# Altium schematic sheet Main_Board_Schematic.SchDoc
size A4; SheetNumber: 1; SheetTotal: 1
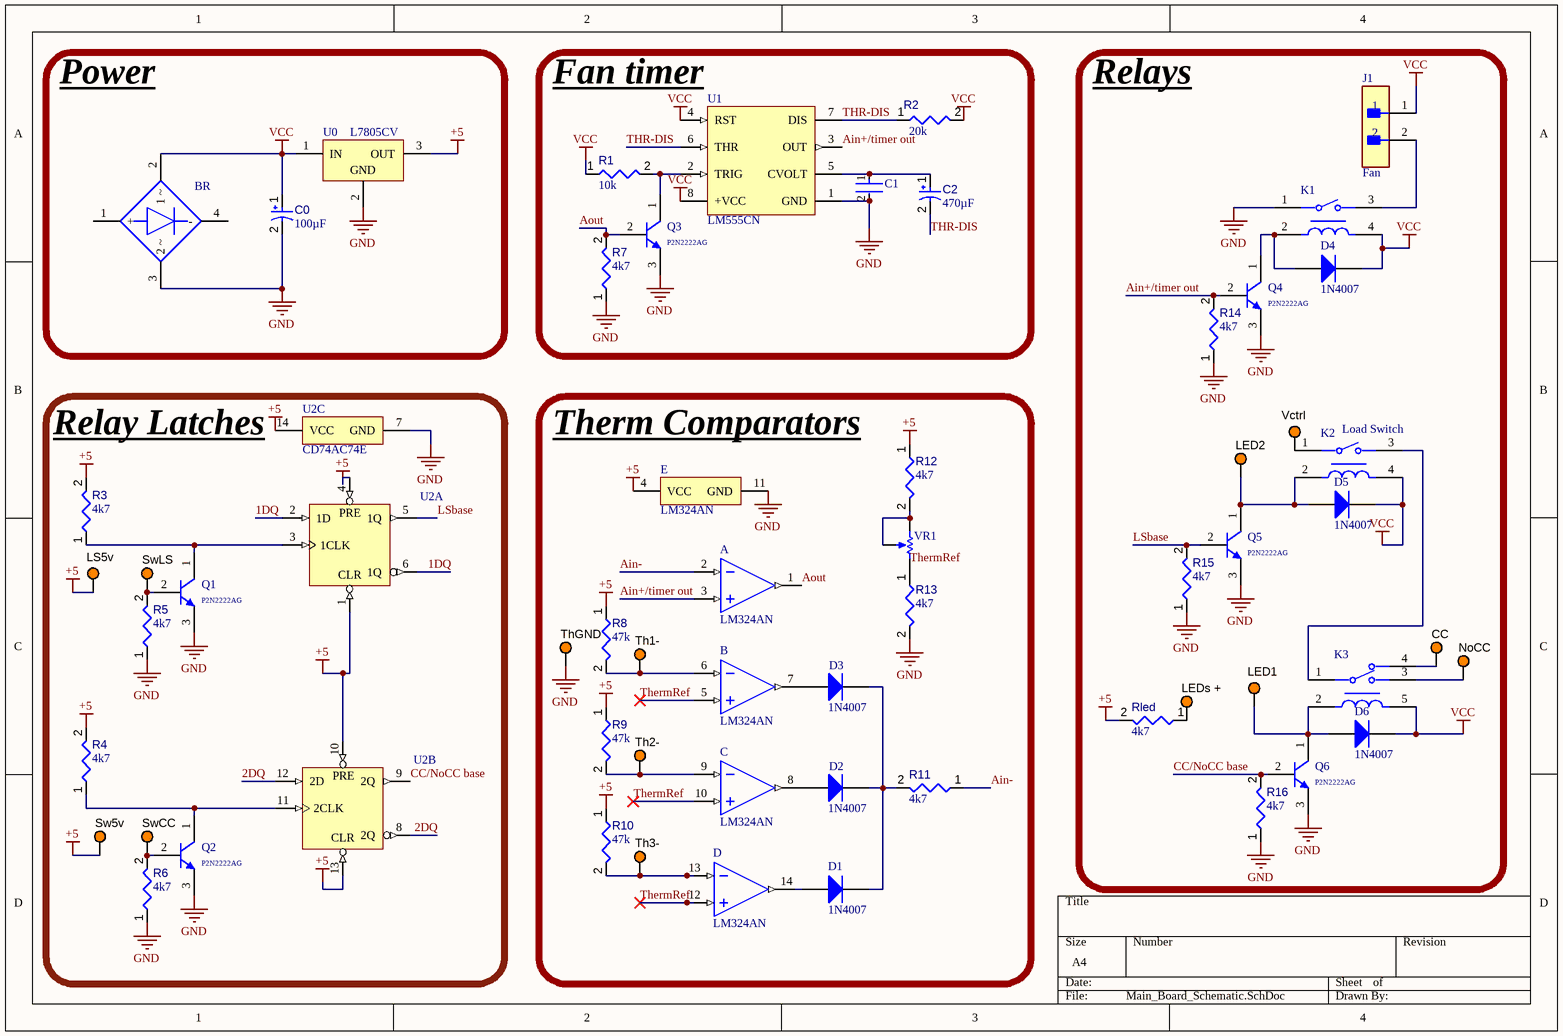
[diagram p0: Main_Board_Schematic.SchDoc]

## Parts
(Parts that share a designator on the sheet are numbered #1, #2 ... from top to bottom, then left to right.)
?#1  LM324AN  [TI-N0014A]  (part E of 5)
?#2  LM324AN  [TI-N0014A]  (part A of 5)
?#3  LM324AN  [TI-N0014A]  (part B of 5)
?#4  LM324AN  [TI-N0014A]  (part C of 5)
?#5  LM324AN  [TI-N0014A]  (part D of 5)
BR  GBU8D  [FP-127EL-MFG]  (value not drawn)
C0  value 100µF  [CAPPR55-250-1120X630X1220]  (hidden comment: ECA-2AM220)
C1  RCER71H103K0K1H03B  [FP-RCE0K1-MFG]  (value not drawn)
C2  value 470µF  [CAPPR65-350-1150X800X1250]  (hidden comment: ECA1HM101)
CC  5003  [KSTN-5003]  (value not drawn)
D1  1N4007  [FAIR-DO-41-2]
D2  1N4007  [FAIR-DO-41-2]
D3  1N4007  [FAIR-DO-41-2]
D4  1N4007  [FAIR-DO-41-2]
D5  1N4007  [FAIR-DO-41-2]
D6  1N4007  [FAIR-DO-41-2]
J1  Fan  [FP-B2B-XH-A_LF_SN-MFG]
K1  LKQ1AF-5V-TV-5  [FP-LKQ1AF-5V-TV-5-MFG]  (value not drawn)
K2  Load Switch  [FP-LKQ1AF-5V-TV-5-MFG]
K3  G5LE-14-36 DC12  [FP-G5LE-14-36_DC12-MFG]  (value not drawn)
LED1  5003  [KSTN-5003]  (value not drawn)
LED2  5003  [KSTN-5003]  (value not drawn)
LEDs_+  5003  [KSTN-5003]  (value not drawn)
LS5v  5003  [KSTN-5003]  (value not drawn)
NoCC  5003  [KSTN-5003]  (value not drawn)
Q1  P2N2222AG  [ONSC-TO-92-3-29-11]
Q2  P2N2222AG  [ONSC-TO-92-3-29-11]
Q3  P2N2222AG  [ONSC-TO-92-3-29-11]
Q4  P2N2222AG  [ONSC-TO-92-3-29-11]
Q5  P2N2222AG  [ONSC-TO-92-3-29-11]
Q6  P2N2222AG  [ONSC-TO-92-3-29-11]
R1  value 10k  [RESA60-630X240]  (hidden comment: MFR-25FBF52-1K)
R2  value 20k  [RESA60-630X240]  (hidden comment: MFR-25FBF52-1K)
R3  value 4k7  [RESA60-630X240]  (hidden comment: MFR-25FBF52-100R)
R4  value 4k7  [RESA60-630X240]  (hidden comment: MFR-25FBF52-100R)
R5  value 4k7  [RESA60-630X240]  (hidden comment: MFR-25FBF52-100R)
R6  value 4k7  [RESA60-630X240]  (hidden comment: MFR-25FBF52-100R)
R7  value 4k7  [RESA60-630X240]  (hidden comment: MFR-25FBF52-100R)
R8  value 47k  [RESA60-630X240]  (hidden comment: MFR-25FBF52-100R)
R9  value 47k  [RESA60-630X240]  (hidden comment: MFR-25FBF52-100R)
R10  value 47k  [RESA60-630X240]  (hidden comment: MFR-25FBF52-100R)
R11  value 4k7  [RESA60-630X240]  (hidden comment: MFR-25FBF52-100R)
R12  value 4k7  [RESA60-630X240]  (hidden comment: MFR-25FBF52-100R)
R13  value 4k7  [RESA60-630X240]  (hidden comment: MFR-25FBF52-100R)
R14  value 4k7  [RESA60-630X240]  (hidden comment: MFR-25FBF52-100R)
R15  value 4k7  [RESA60-630X240]  (hidden comment: MFR-25FBF52-100R)
R16  value 4k7  [RESA60-630X240]  (hidden comment: MFR-25FBF52-100R)
Rled  value 4k7  [RESA60-630X240]  (hidden comment: MFR-25FBF52-100R)
Sw5v  5003  [KSTN-5003]  (value not drawn)
SwCC  5003  [KSTN-5003]  (value not drawn)
SwLS  5003  [KSTN-5003]  (value not drawn)
Th1-  5003  [KSTN-5003]  (value not drawn)
Th2-  5003  [KSTN-5003]  (value not drawn)
Th3-  5003  [KSTN-5003]  (value not drawn)
ThGND  5003  [KSTN-5003]  (value not drawn)
U0  L7805CV  [TO220]
U1  LM555CN  [N08E]
U2  CD74AC74E  [N0014A]  (value not drawn)  (parts A,B,C of 3)
Vctrl  5003  [KSTN-5003]  (value not drawn)
VR1  3362P-1-104LF  [BOUR-3362P]  (value not drawn)

## Blocks framed on the sheet
Power: BR C0 U0
Fan timer: C1 C2 Q3 R1 R2 R7 U1
Relays: CC D4-D6 J1 K1-K3 LED1 LED2 LEDs_+ NoCC Q4-Q6 R14-R16 Rled Vctrl
Relay Latches: LS5v Q1 Q2 R3-R6 Sw5v SwCC SwLS U2
Therm Comparators: ?#1-?#5 D1-D3 R8-R13 Th1- Th2- Th3- ThGND VR1

## Nets
+5: ?#1.4(VCC) LS5v.1 R3.2 R4.2 R8.1 R9.1 R10.1 R12.1 Rled.2 Sw5v.1 U0.3(OUT) U2.1(1~{CLR}) U2.4(1~{PRE}) U2.10(2~{PRE}) U2.13(2~{CLR}) U2.14(VCC)
GND: ?#1.11(GND) BR.3(2_~) C0.2 C1.2 K1.1 Q1.3(E) Q2.3(E) Q3.3(E) Q4.3(E) Q5.3(E) Q6.3(E) R5.1 R6.1 R7.1 R13.2 R14.1 R15.1 R16.1 ThGND.1 U0.2(GND) U1.1(GND) U2.7(GND)
VCC: BR.2(1_~) C0.1 D4.1(K) D5.1(K) D6.1(K) J1.1 K1.4 K2.4 K3.5 R1.1 R2.2 U0.1(IN) U1.4(RST) U1.8(+VCC)
1DQ: U2.2(1D) U2.6(1Q)
2DQ: U2.8(2Q) U2.12(2D)
Ain+/timer out: ?#2.3(1IN+) Q4.2(B) R14.2 U1.3(OUT)
Ain-: ?#2.2(1IN-) R11.1
Aout: ?#2.1(1OUT) Q3.2(B) R7.2
CC/NoCC base: Q6.2(B) R16.2 U2.9(2Q)
LSbase: Q5.2(B) R15.2 U2.5(1Q)
ThermRef: ?#3.5(2IN+) ?#4.10(3IN+) ?#5.12(4IN+)
THR-DIS: C2.2 R2.1 U1.6(THR) U1.7(DIS)
Net?#3_6: ?#3.6(2IN-) R8.2 Th1-.1
Net?#3_7: ?#3.7(2OUT) D3.2(A)
Net?#4_8: ?#4.8(3OUT) D2.2(A)
Net?#4_9: ?#4.9(3IN-) R9.2 Th2-.1
Net?#5_13: ?#5.13(4IN-) R10.2 Th3-.1
Net?#5_14: ?#5.14(4OUT) D1.2(A)
NetC1_1: C1.1 C2.1 U1.5(CVOLT)
NetCC_1: CC.1 K3.4
NetD1_1: D1.1(K) D2.1(K) D3.1(K) R11.2
NetD4_2: D4.2(A) K1.2 Q4.1(C)
NetD5_2: D5.2(A) K2.2 LED2.1 Q5.1(C)
NetD6_2: D6.2(A) K3.2 LED1.1 Q6.1(C)
NetJ1_2: J1.2 K1.3
NetK2_1: K2.1 Vctrl.1
NetK2_3: K2.3 K3.1
NetK3_3: K3.3 NoCC.1
NetLEDs_+_1: LEDs_+.1 Rled.1
NetQ1_1: Q1.1(C) R3.1 U2.3(1CLK)
NetQ1_2: Q1.2(B) R5.2 SwLS.1
NetQ2_1: Q2.1(C) R4.1 U2.11(2CLK)
NetQ2_2: Q2.2(B) R6.2 SwCC.1
NetQ3_1: Q3.1(C) R1.2 U1.2(TRIG)
NetR12_2: R12.2 VR1.1(CCW) VR1.2(S)
NetR13_1: R13.1 VR1.3(CW)

Not connected (* = marked no-connect by the designer): BR 1(+) 4(-)

## Notes on the sheet
- Labels drawn without touching a wire or pin: ThermRef
- (in symbol CMP-1619-00741-2, part A) PRE; CLR
- (in symbol CMP-1619-00741-2, part B) PRE; CLR

## Library data of the parts
?#1-?#5 = CMP-014-00016-2: Quadruple Operational Amplifier, 1.2 MHz, 0 to 70 degC, 14-Pin PDIP (N), Pb-Free (RoHS), Tube; Manufacturer: Texas Instruments (TI); Max Dual Supply Voltage: 16V; Nominal Dual Supply Voltage: 12V; Nominal Voltage Gain: 100dB; Min Supply Voltage: 1.5V; Unity Gain Bandwidth Product: 1.2MHz; Output Current: 30mA; Nominal Supply Current: 3mA; RoHS Compliant: True; Package Reference: N-14; Min Operating Temperature: 0°C; Case/Package: DIP; Mounting Technology: TH; Package Description: 14-Pin Double In-line Package, Body 19.305 x 6.35 mm, Pitch 2.54 mm; Nominal Supply Voltage: 12V; Package URL: http://www.ti.com/lit/ml/mpdi002c/mpdi002c.pdf; Package Quantity: 25; Datasheet Version: SLOS066W, 03/2015; Manufacturer URL: http://www.ti.com/; Datasheet URL: http://www.ti.com/lit/ds/symlink/lm324a.pdf; Min Dual Supply Voltage: 1.5V; Max Supply Voltage: 16V; Pins: 14; Max Operating Temperature: 70°C
BR = CMP-00278-84328822-1: GBU8D Diode Rectifier Bridge Single 200V 8A 4-Pin Case GBU Rail; Manufacturer Lifecycle Status: ACTIVE; Peak Reverse Current: 5µA; Max Forward Surge Current (Ifsm): 200A; Max Reverse Leakage Current: 50µA; Forward Voltage: 1V; Max Junction Temperature (Tj): 150°C; Number of Elements: 1; Power Dissipation: 16W; Element Configuration: Single; Radiation Hardening: No; Lifecycle Status: Production; Min Operating Temperature: -55°C; Height: 18.8mm; NexarPartId: 84328822; Mount: Through Hole; Width: 3.56mm; RoHS: Compliant; Average Rectified Current: 8A; Length: 22.3mm; Lead Free: Lead Free; Forward Current: 8A; Output Current: 8A; Max Operating Temperature: 150°C; Number of Pins: 4; Max Repetitive Reverse Voltage (Vrrm): 200V; Voltage Rating (DC): 200V; Weight: 5.4g; Contact Plating: Tin; Max Surge Current: 200A; Schedule B: 8541100080; Current Rating: 8A; REACH SVHC: No SVHC; Case/Package: SIP; Peak Non-Repetitive Surge Current: 200A; Reverse Voltage: 200V
C0 = CMP-001-00035-7: Aluminum Electrolytic Capacitor, 22 uF, +/- 20%, 100 V, -40 to 85 degC, 2-Pin THD, RoHS, Bulk; Manufacturer: Panasonic; Voltage Rating: 100V; Ripple Current: 115mA; Manufacturer URL: http://www.panasonic.com/; Packaging: Bulk; Package Description: 2-Pin Radial Lead, Dia 6.3 mm, Height 12.2 mm; Datasheet URL: https://industrial.panasonic.com/cdbs/www-data/pdf/RDF0000/ABA0000C1047.pdf; RoHS Compliant: True; Package Quantity: 200; Case/Package: Radial; Package Reference: CAPPR55-250-1120X630X1220; Datasheet Version: Mar-16; Pins: 2; Tolerance: 20%; Diameter: 6.3mm; Max Operating Temperature: 85°C; Ripple Current (AC): 115mA; Capacitor Type: Electrolytic; Mounting Technology: TH; Min Operating Temperature: -40°C; Lead Pitch: 2.5mm
C1 = CMP-06035-044411-1: Cap Ceramic 10nF 50V X7R ±10% Radial 5mm +125°C Automotive Bulk; Lead/Base Style: Formed Leads; Lead Diameter: 0.5mm; Resistor Type: Ceramic; Mount: Through Hole; Capacitance: 10nF; Lead Pitch: 0.197inch; Package Quantity: 500; Dielectric: X7R; Lead Free: Lead Free; Min Operating Temperature: -55°C; Packaging: Bulk; Width: 0.098inch; Length: 0.142inch; Voltage Rating: 50V; Case/Package: Radial; Max Operating Temperature: 125°C; Ratings: AEC-Q200; Height - Seated (Max): 0.138inch; Height: 3.5mm; Termination: Radial; Voltage Rating (DC): 50V; Tolerance: 10%
C2 = CMP-001-00026-7: Aluminum Electrolytic Capacitor, 100 uF, +/- 20%, 50 V, -40 to 85 degC, 2-Pin THD, RoHS, Bulk; Manufacturer: Panasonic; Voltage Rating: 50V; Ripple Current: 250mA; Datasheet URL: https://industrial.panasonic.com/cdbs/www-data/pdf/RDF0000/ABA0000C1218.pdf; Lead Pitch: 3.5mm; Mounting Technology: TH; Package Description: 2-Pin Radial Lead, Dia 8 mm, Height 12.5 mm; Diameter: 8mm; Ripple Current (AC): 250mA; Manufacturer URL: http://www.panasonic.com/; Capacitor Type: Electrolytic; Max Operating Temperature: 85°C; Pins: 2; Min Operating Temperature: -40°C; Tolerance: 20%; Case/Package: Radial; Packaging: Bulk; Package Quantity: 200; Package Reference: CAPPR65-350-1150X800X1250; RoHS Compliant: True; Datasheet Version: Rev. 05, 10/2016
CC LED1 LED2 LEDs_+ LS5v NoCC Sw5v SwCC SwLS Th1- Th2- Th3- ThGND Vctrl = CMP-002-00037-2: Test Point, Orange, Height 4.6 mm, Tail Length 3 mm, 1-Pin THD, RoHS; Manufacturer: Keystone; Colour: Orange; Packaging: Bulk; Package Description: 1-Pin Through Hole Device, Dia 2.54 mm; Pins: 1; Package Reference: 5003; Datasheet Version: Jun-15; Case/Package: 5003; Mounting Technology: TH; Connector Type: TestPoint; Diameter: 2.54mm; Contact Material: Bronze; Datasheet URL: http://keyelco.com/userAssets/file/M65p56.pdf; Manufacturer URL: http://www.keyelco.com/; Package Quantity: 10; Contact Plating: Tin; RoHS Compliant: True
D1-D6 = CMP-004-00007-2: General Purpose Rectifier, 1.1 V, 1.0 A, -55 to 175 degC, 2-Pin DO-41, RoHS, Tape and Reel; Manufacturer: Fairchild; Peak Reverse Current: 5uA; Max Surge Current: 30A; Elements: 1; Forward Voltage: 1.1V; Package Version: Rev. 2, 09/2008; Forward Current: 1A; Package Quantity: 5000; Packaging: TapeandReel; Package URL: http://www.fairchildsemi.com/dwg/DO/DO41A.pdf; Manufacturer URL: https://www.fairchildsemi.com/; Package Reference: DO-41-2; Pins: 2; Min Operating Temperature: -55°C; Datasheet Version: Rev. 1.1.0, 11/2014; Max Operating Temperature: 175°C; RoHS Compliant: True; Case/Package: DO-41-2; Mounting Technology: TH; Package Description: 2-Pin Axial Lead, Dia 2.375 mm, Body Length 4.63 mm; Datasheet URL: https://www.fairchildsemi.com/datasheets/1N/1N4007.pdf
J1 = CMP-2000-05888-3: CONN HEADER VERT 2POS 2.5MM; Current Rating: 3A; Voltage Rating: 250V; Number of Contacts: 2; Contact Resistance: 20mR; Wire/Cable Gauge: 22AWG; Insulation Resistance: 1GR; Connector Type: Male Pin; Packaging: Bulk; Contact Material: Brass; Lead Free: Lead Free; Orientation: Straight; Contact Plating: Tin; Max Current Rating: 3A; Termination: Solder; Fastening Type: Detent; Depth: 5.75mm; Housing Material: Polyamide; REACH SVHC: No SVHC; Series: XH; Voltage Rating (AC): 250V; Number of Positions: 2; Color: Natural; Contact Type: Male Pin; Max Voltage Rating (DC): 250V; Pitch: 2.5mm; Lead Pitch: 2.5mm; Mount: Through Hole; Max Operating Temperature: 85°C; Length: 7.4mm; Max Voltage Rating (AC): 250V; Min Operating Temperature: -25°C; Number of Rows: 1; Housing Color: White
K1 K2 = CMP-008-00006-1: Quiet Type, High Sensitivity 250MW, Slim Power Relay
K3 = CMP-08822-000072-1: RELAY GEN PURPOSE SPDT 10A 12V; Coil Resistance: 400R; Release Time: 5ms; Max Voltage Rating (DC): 125V; Coil Current: 30mA; Coil Power: 360mW; Relay Type: General Purpose; Coil Type: Non-Latching; Max Voltage Rating (AC): 250V; Operate Time: 10ms; Package Quantity: 100; Number of Pins: 5; Mount: Through Hole; Termination: PC Pin; Series: G5LE; Min Operating Temperature: -25°C; Max Operating Temperature: 85°C; Throw Configuration: SPDT; Coil Voltage (DC): 12V; Radiation Hardening: No; Contact Current Rating: 10A; Packaging: Tray; Contact Material: Tin
Q1-Q6 = CMP-1048-01402-1: Amplifier Transistor, NPN Silicon, 3-Pin TO-92, Pb-Free, Bulk Box; Manufacturer: On Semiconductor; IC Continuous (A): 0.6; fT Min (MHz): 300; ComponentLink2Description: Datasheet; ComponentLink1Description: Manufacturer URL; ComponentLink2URL: http://www.onsemi.com/pub_link/Collateral/P2N2222A-D.PDF; ComponentLink3Description: Package Specification; RoHS: TRUE; ComponentLink1URL: http://www.onsemi.com/; PartNumber: P2N2222AG; Mounting Technology: Through Hole; PackageReference: TO-92-3-29-11_AM_SL; Polarity: NPN; Packing: Bulk Box; DatasheetVersion: Rev. 7; PackageDescription: 3-Pin Transistor Outline, Body 4.825 x 3.685 mm, Pitch 1.27 mm; PackageVersion: Rev. AM; ComponentLink3URL: http://www.onsemi.cn/pub_link/Collateral/2N6426-D.PDF
R1 R2 = CMP-009-00048-4: Axial Resistor, 1 KOhm, +/- 1%, 250 mW, -55 to 155 degC, 2-Pin THD, RoHS, Bulk; Manufacturer: Yageo; Voltage Rating: 250V; Power: 250mW; Min Operating Temperature: -55°C; Max Operating Temperature: 155°C; Tolerance: 1%; Package Reference: MFR-25; Composition: CarbonFilm; Mounting Technology: TH; Packaging: Bulk; Case/Package: Axial; Datasheet URL: http://www.yageo.com/documents/recent/Yageo%20LR_MFR_2013.pdf; Package Quantity: 200; Manufacturer URL: http://www.yageo.com/; Package Description: 2-Pin Axial Lead, Dia 2.4 mm, Body Length 6.3 mm; Datasheet Version: Apr-13; RoHS Compliant: True
R3-R16 Rled = CMP-009-00046-4: Axial Resistor, 100 Ohm, +/- 1%, 0.25 W, -55 to 155 degC, 2-Pin THD, RoHS, Bulk; Manufacturer: Yageo; Voltage Rating: 250V; Power: 250mW; Packaging: Bulk; Max Operating Temperature: 155°C; Mounting Technology: TH; Datasheet Version: Apr-13; Case/Package: Axial; RoHS Compliant: True; Package Description: 2-Pin Axial Lead, Dia 2.4 mm, Body Length 6.3 mm; Package Quantity: 200; Package Reference: MFR-25; Tolerance: 1%; Composition: CarbonFilm; Datasheet URL: http://www.yageo.com/documents/recent/Yageo%20LR_MFR_2013.pdf; Manufacturer URL: http://www.yageo.com/; Min Operating Temperature: -55°C
U0 = CMP-0244-00483-1: Positive Voltage Regulator, 5V, 3-Pin TO-220; PackageDescription: TO, Thru-Hole, Vertical, Heatsink Mounted; 3 In-Line Leads; Pitch 2.54 mm; ComponentLink2Description: Datasheet; PackageReference: TO220; ComponentLink3URL: http://www.st.com/internet/com/TECHNICAL_RESOURCES/TECHNICAL_LITERATURE/PACKAGE_INFORMATION/CD00004649.pdf; DatasheetVersion: 16/11/2011; ComponentLink1Description: Manufacturer URL; ComponentLink1URL: http://www.st.com; PackageVersion: ver3.0; ComponentLink3Description: Package Specification; ComponentLink2URL: http://www.st.com/internet/com/TECHNICAL_RESOURCES/TECHNICAL_LITERATURE/DATASHEET/CD00000444.pdf
U1 = CMP-0056-00017-2: Timer, 8-pin MDIP; Manufacturer: National Semiconductor; CompType: Analog IC; PackageTopMarking: NSUZXYTTE#*LM*555CN; PowerWise: N; PackageReference: N08E; ComponentLink1Description: LM555 Datasheet; ComponentLink3URL: http://www.national.com/packaging/folders/n08e.html; ComponentLink1URL: http://www.national.com/ds/LM/LM555.pdf; ComponentLink2URL: http://www.national.com/pf/LM/LM555.html; PackageDescription: MDIP, .365 x .250 x .130in, 8 Lead, .100in Pitch; DatasheetVersion: Jul-2006; RevisionNote: Component URLs added; Code_JEDEC: MS-001-BA; PinCount: 8; ComponentLink3Description: N08E Package Page; PackageVersion: revG, May-2006; ComponentLink2Description: LM555 Web Page; RoHS: N
U2 = CMP-1619-00741-2: Dual Positive-Edge-Triggered D-Type Flip-Flops with Set and Reset, N0014A, TUBE; Manufacturer: Texas Instruments; VCC(Min)(V): 1.5; Rating: Catalog; Voltage(Nom)(V): 1.5,3.3,5; VCC(Max)(V): 5.5; Technology Family: AC; Input Type: CMOS; ICC @ Nom Voltage(Max)(mA): 0.04; Schmitt Trigger: No; F @ Nom Voltage(Max)(Mhz): 100; Output Drive (IOL/IOH)(Max)(mA): 24/-24; Output Logic: Inverted,Non-inverted; tpd @ Nom Voltage(Max)(ns): 114,12.7,9.1; Bits(#): 2; Generic Part Number: CD74AC74; Operating Temperature Range(C): -55 to 125; Code_JEDEC: MS-001; 3-State Output: No; PackageReference: N0014A; DatasheetVersion: SCHS231D; Output Type: CMOS
VR1 = CMP-009-00040-2: Square Trimpot(R) Trimming Potentiometer, 100 KOhm, 300 V, -55 to 125 degC, 3-Pin THD, RoHS, Tube; Manufacturer: Bourns; Voltage Rating: 300V; Resistance: 100k; Power: 500mW; Tolerance: 10%; RoHS Compliant: True; Mounting Technology: TH; Datasheet URL: http://www.bourns.com/docs/Product-Datasheets/3362.pdf; Min Operating Temperature: -55°C; Composition: Potentiometer; Package Quantity: 250; Lead Pitch: 2.54mm; Case/Package: 3326P; Package Description: 3-Pin Through Hole Device, Body 6.6 x 6.99 mm, Pitch 2.54 mm; Datasheet Version: May-16; Packaging: Rail/Tube; Package Reference: 3326P; Manufacturer URL: http://www.bourns.com/; Max Operating Temperature: 125°C